# EAGLE design Ade9153A_Module (EAGLE 9.6.2)
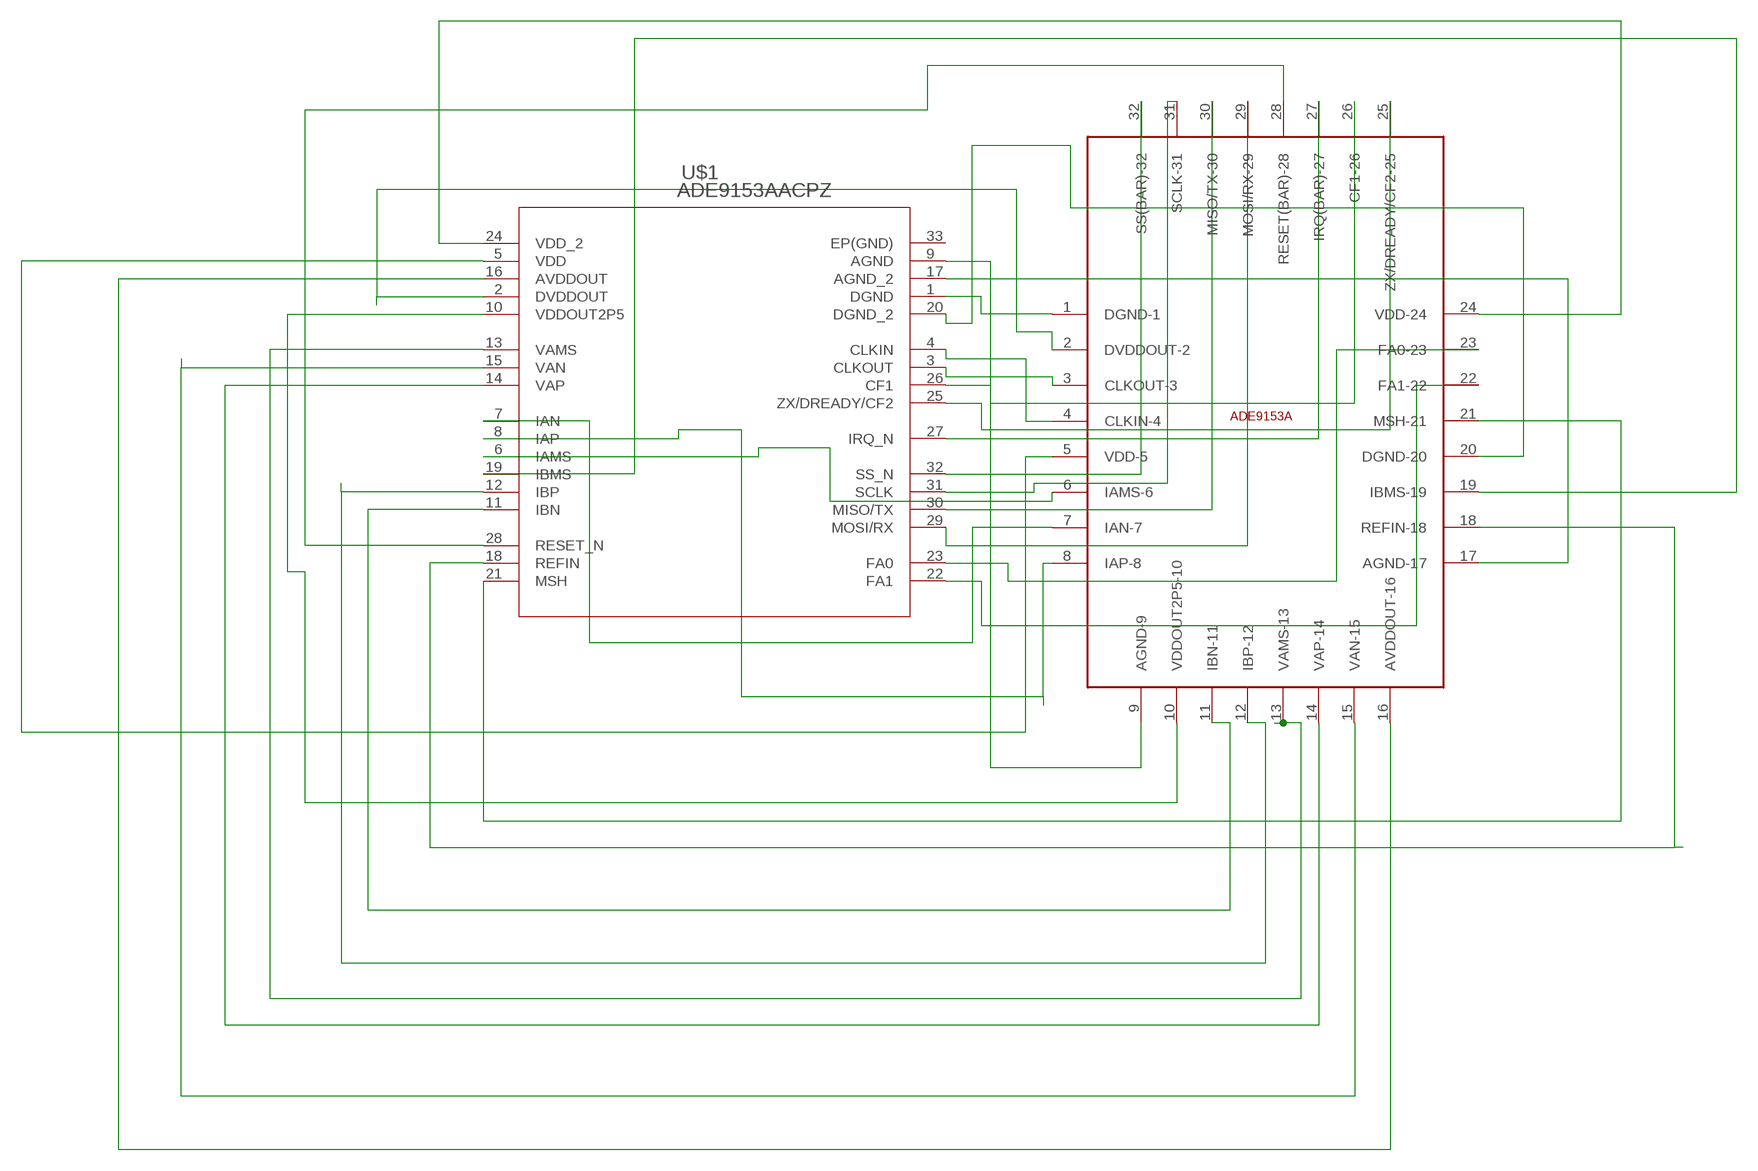
[diagram p0: schematic, sheet 1]

## Parts
U$1  ADE9153AACPZ  [QFN50P500X500X80-33N]
U$2  ADE9153A_BASEADE9153A_BASE  [ADE9153A_BASE]

## Nets
N$1: U$1.1(DGND) U$2.1(DGND-1)
N$2: U$1.4(CLKIN) U$2.4(CLKIN-4)
N$3: U$1.3(CLKOUT) U$2.3(CLKOUT-3)
N$4: U$1.26(CF1) U$2.26(CF1-26)
N$5: U$1.25(ZX/DREADY/CF2) U$2.25(ZX/DREADY/CF2-25)
N$6: U$1.27(IRQ_N) U$2.27(IRQ(BAR)-27)
N$7: U$1.32(SS_N) U$2.32(SS(BAR)-32)
N$8: U$1.31(SCLK) U$2.31(SCLK-31)
N$9: U$1.30(MISO/TX) U$2.30(MISO/TX-30)
N$10: U$1.29(MOSI/RX) U$2.29(MOSI/RX-29)
N$11: U$1.23(FA0) U$2.23(FA0-23)
N$12: U$1.22(FA1) U$2.22(FA1-22)
N$13: U$1.17(AGND_2) U$2.17(AGND-17)
N$14: U$1.9(AGND) U$2.9(AGND-9)
N$15: U$1.21(MSH) U$2.21(MSH-21)
N$16: U$1.18(REFIN) U$2.18(REFIN-18)
N$17: U$1.28(RESET_N) U$2.28(RESET(BAR)-28)
N$18: U$1.11(IBN) U$2.11(IBN-11)
N$19: U$1.12(IBP) U$2.12(IBP-12)
N$20: U$1.13(VAMS) U$2.13(VAMS-13)
N$21: U$1.14(VAP) U$2.14(VAP-14)
N$22: U$1.15(VAN) U$2.15(VAN-15)
N$23: U$1.16(AVDDOUT) U$2.16(AVDDOUT-16)
N$24: U$1.10(VDDOUT2P5) U$2.10(VDDOUT2P5-10)
N$25: U$1.19(IBMS) U$2.19(IBMS-19)
N$26: U$1.6(IAMS) U$2.6(IAMS-6)
N$27: U$1.7(IAN) U$2.7(IAN-7)
N$28: U$1.8(IAP) U$2.8(IAP-8)
N$29: U$1.2(DVDDOUT) U$2.2(DVDDOUT-2)
N$30: U$1.24(VDD_2) U$2.24(VDD-24)
N$31: U$1.5(VDD) U$2.5(VDD-5)
N$32: U$1.20(DGND_2) U$2.20(DGND-20)
Unconnected: U$1.33(EP(GND))

## Library data of the parts
U$1 = ADE9153AACPZ:ADE9153AACPZ: Check availability <https://pricing.snapeda.com/parts/ADE9153AACPZ/Analog%20Devices/view-part?ref=eda>; AVAILABILITY: In Stock; DESCRIPTION: Energy Metering IC with Autocalibration; MF: Analog Devices; MP: ADE9153AACPZ; PACKAGE: LFCSP -32 Analog Devices; PRICE: None; PURCHASE-URL: https://pricing.snapeda.com/search/part/ADE9153AACPZ/?ref=eda
U$2 = ADE9153A_base:ADE9153A_BASE

## Board
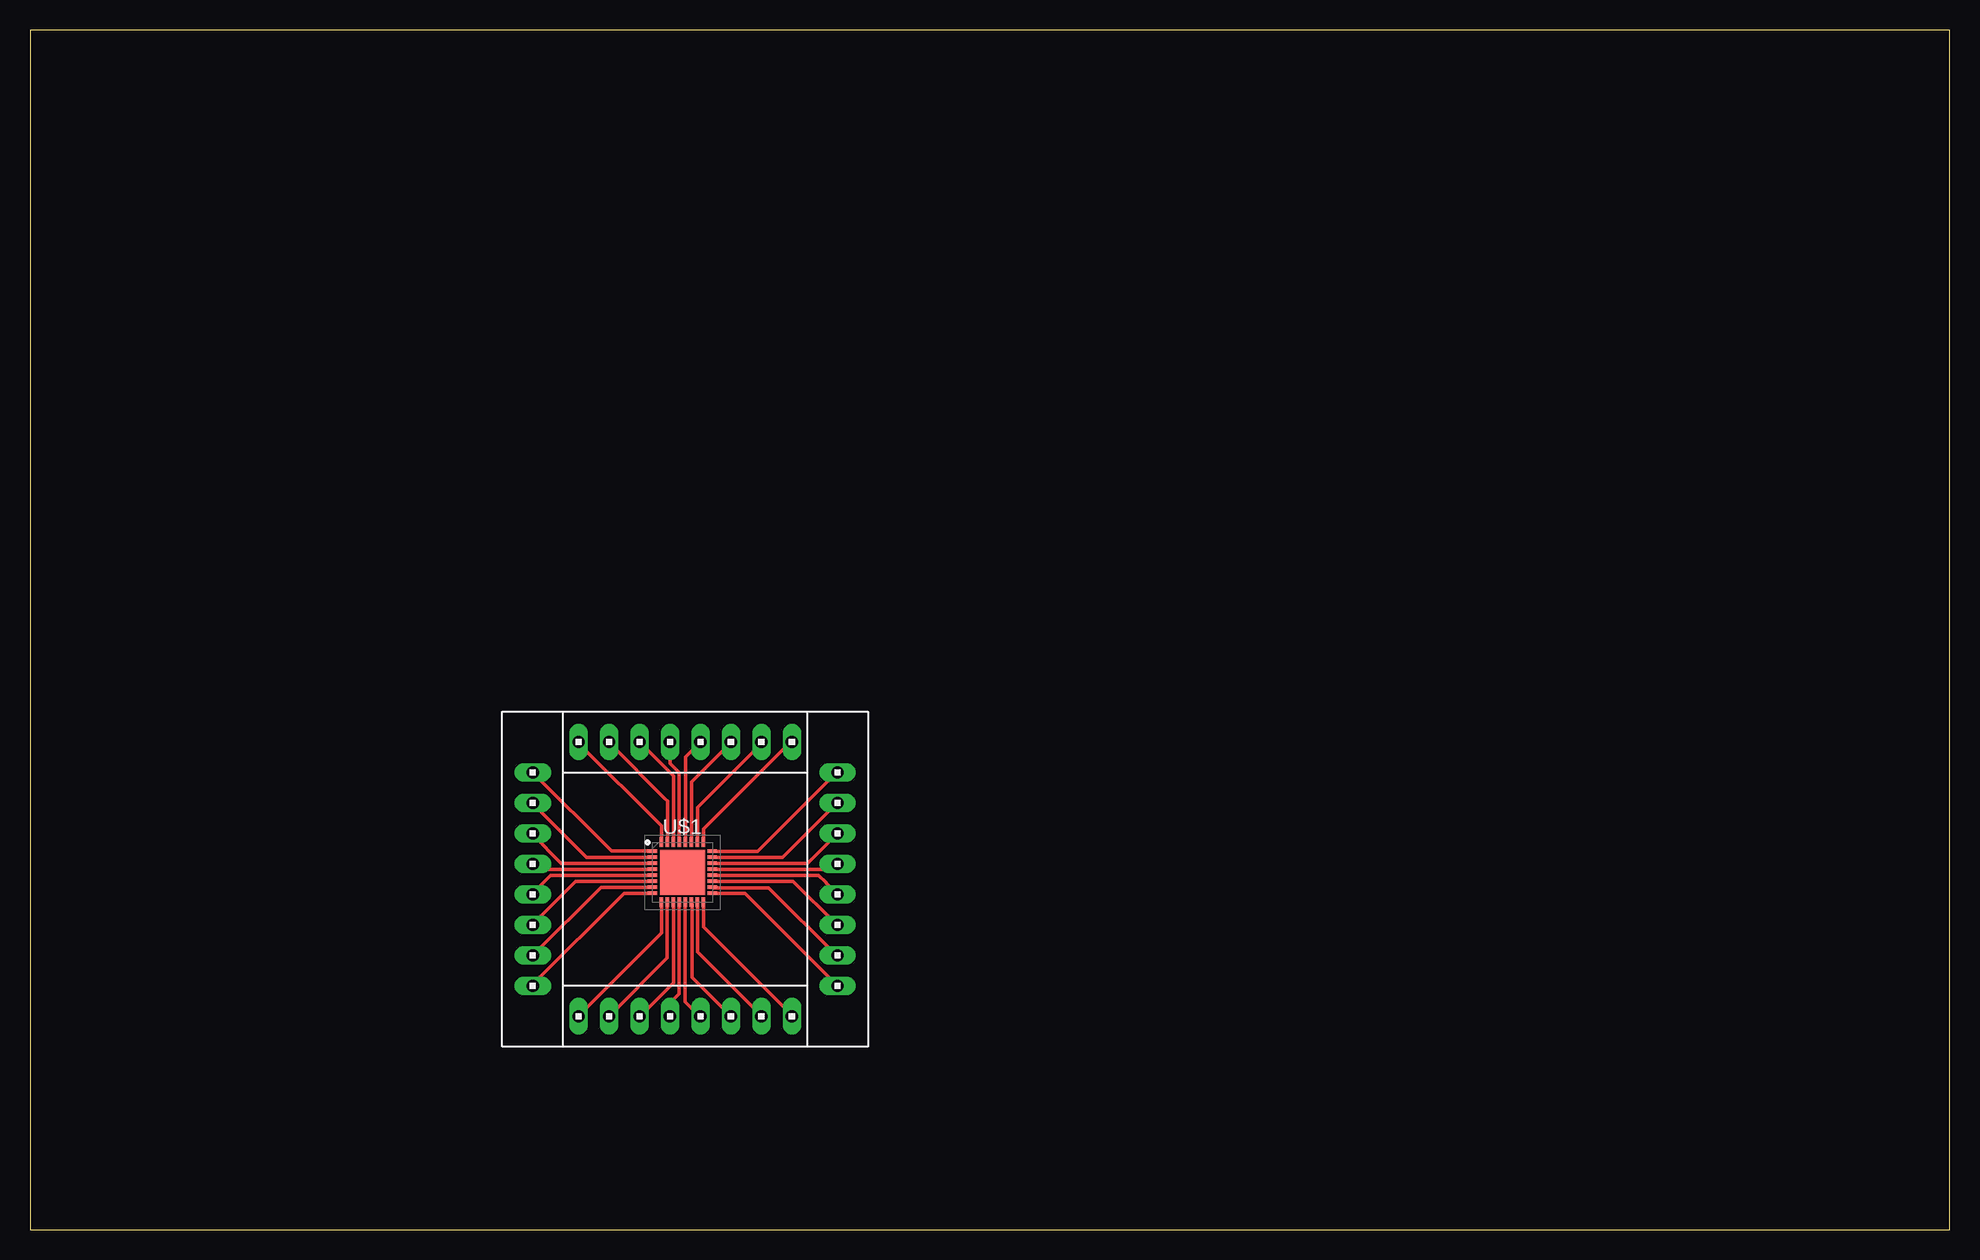
[diagram p1: board, top side]

Size 160 x 100 mm. Coordinates in mm from the lower left corner, seen from the top.
Outline: 0,0 160,0 160,100 0,100 0,0
Copper layers (1*16): Top 0.035mm / dielectric 1.5mm / Bottom 0.035mm
Design rules "default": minimum track width 6mil, minimum drill 0.35mm, track to track 6mil, track to pad 6mil, pad to pad 6mil, via to via 6mil, smd to smd 6mil, copper to edge 40mil, drill to drill 6mil, minimum pad ring 10mil, minimum via ring 8mil, stop-mask expansion 4mil, vias tented up to drill 0mil, thermal gap 10mil

### Footprints (pad centres in the part's own frame; a part is rotated, then mirrored left to right if it is on the bottom)
QFN50P500X500X80-33N = smd 0.8 x 0.3: 1 -2.5,1.75; 2 -2.5,1.25; 3 -2.5,0.75; 4 -2.5,0.25; 5 -2.5,-0.25; 6 -2.5,-0.75; 7 -2.5,-1.25; 8 -2.5,-1.75; 17 2.5,-1.75; 18 2.5,-1.25; 19 2.5,-0.75; 20 2.5,-0.25; 21 2.5,0.25; 22 2.5,0.75; 23 2.5,1.25; 24 2.5,1.75 | smd 0.3 x 0.8: 9 -1.75,-2.5; 10 -1.25,-2.5; 11 -0.75,-2.5; 12 -0.25,-2.5; 13 0.25,-2.5; 14 0.75,-2.5; 15 1.25,-2.5; 16 1.75,-2.5; 25 1.75,2.5; 26 1.25,2.5; 27 0.75,2.5; 28 0.25,2.5; 29 -0.25,2.5; 30 -0.75,2.5; 31 -1.25,2.5; 32 -1.75,2.5 | smd 3.75 x 3.75: 33 0,0
ADE9153A_BASE = drill 1.016 long: 1 -6.35,-5.08; 2 -6.35,-7.62; 3 -6.35,-10.16; 4 -6.35,-12.7; 5 -6.35,-15.24; 6 -6.35,-17.78; 7 -6.35,-20.32; 8 -6.35,-22.86; 9 -2.54,-25.4; 10 0,-25.4; 11 2.54,-25.4; 12 5.08,-25.4; 13 7.62,-25.4; 14 10.16,-25.4; 15 12.7,-25.4; 16 15.24,-25.4; 17 19.05,-22.86; 18 19.05,-20.32; 19 19.05,-17.78; 20 19.05,-15.24; 21 19.05,-12.7; 22 19.05,-10.16; 23 19.05,-7.62; 24 19.05,-5.08; 25 15.24,-2.54; 26 12.7,-2.54; 27 10.16,-2.54; 28 7.62,-2.54; 29 5.08,-2.54; 30 2.54,-2.54; 31 0,-2.54; 32 -2.54,-2.54

### Placement (x,y rotation side)
U$1  54.38,29.78 0 top
U$2  48.26,43.18 0 top

### Tracks (layer width: path | path; a pad name or v marks a point on that pad's centre or on a via)
N$1
  Top 0.305: U$2.1 48.46,31.55 51.82,31.55 U$1.1
N$2
  Top 0.305: U$2.4 42.37,30.02 51.82,30.02 U$1.4
N$3
  Top 0.305: U$1.3 51.69,30.54 51.7,30.54 44.29,30.54 41.91,32.92 U$2.3
N$4
  Top 0.305: U$1.26 55.63,32.31 55.63,35.2 60.96,40.54 U$2.26
N$5
  Top 0.305: U$1.25 56.13,33.38 63.39,40.64 U$2.25
N$6
  Top 0.305: U$1.27 55.14,32.29 55.13,32.3 55.13,37.3 58.37,40.54 U$2.27
N$7
  Top 0.305: U$1.32 52.63,33.63 45.72,40.54 U$2.32
N$8
  Top 0.305: U$1.31 53.13,35.72 52.94,35.91 48.26,40.58 U$2.31
N$9
  Top 0.305: U$2.30 53.65,37.8 53.65,32.31 U$1.30
N$10
  Top 0.305: U$1.29 54.11,32.3 54.11,38.09 53.34,38.87 U$2.29
N$11
  Top 0.305: U$1.23 57.13,31.04 62.73,31.04 67.21,35.51 U$2.23
N$12
  Top 0.305: U$2.22 64.83,30.54 57.25,30.54 57.24,30.54 U$1.22
N$13
  Top 0.305: U$2.17 59.6,28.03 U$1.17
N$14
  Top 0.305: U$1.9 52.63,24.74 45.72,17.83 U$2.9
N$15
  Top 0.305: U$1.21 57,30.02 66.75,30.02 67.21,30.48 U$2.21
N$16
  Top 0.305: U$1.18 57,28.5 61.57,28.5 67.21,22.86 U$2.18
N$17
  Top 0.305: U$1.28 54.63,39.38 U$2.28
N$18
  Top 0.305: U$1.11 53.65,27.28 53.65,20.57 50.9,17.83 U$2.11
N$19
  Top 0.305: U$1.12 54.12,27.28 54.12,19.63 53.34,18.85 U$2.12
N$20
  Top 0.305: U$1.13 54.62,27.27 54.62,27.26 54.62,18.99 55.78,17.83 U$2.13
N$21
  Top 0.305: U$2.14 55.17,21.03 55.17,27.28 U$1.14
N$22
  Top 0.305: U$1.15 55.63,23.16 60.96,17.83 U$2.15
N$23
  Top 0.305: U$1.16 56.14,25.25 63.55,17.83 U$2.16
N$24
  Top 0.305: U$2.10 53.12,22.64 53.12,27.28 U$1.10
N$25
  Top 0.305: U$1.19 63.62,29.04 67.21,25.45 U$2.19
N$26
  Top 0.305: U$1.6 45.49,29.03 41.91,25.45 U$2.6
N$27
  Top 0.305: U$1.7 47.59,28.54 U$2.7
N$28
  Top 0.305: U$1.8 49.51,28.02 41.91,20.42 U$2.8
N$29
  Top 0.305: U$1.2 46.39,31.03 41.91,35.51 U$2.2
N$30
  Top 0.305: U$1.24 56.92,31.54 60.65,31.54 67.21,38.1 U$2.24
N$31
  Top 0.305: U$1.5 51.83,29.54 43.41,29.54 41.91,28.04 U$2.5
N$32
  Top 0.305: U$1.20 65.73,29.54 66.34,28.92 66.34,28.91 U$2.20